# EAGLE design COUNTER (EAGLE 7.5.0)
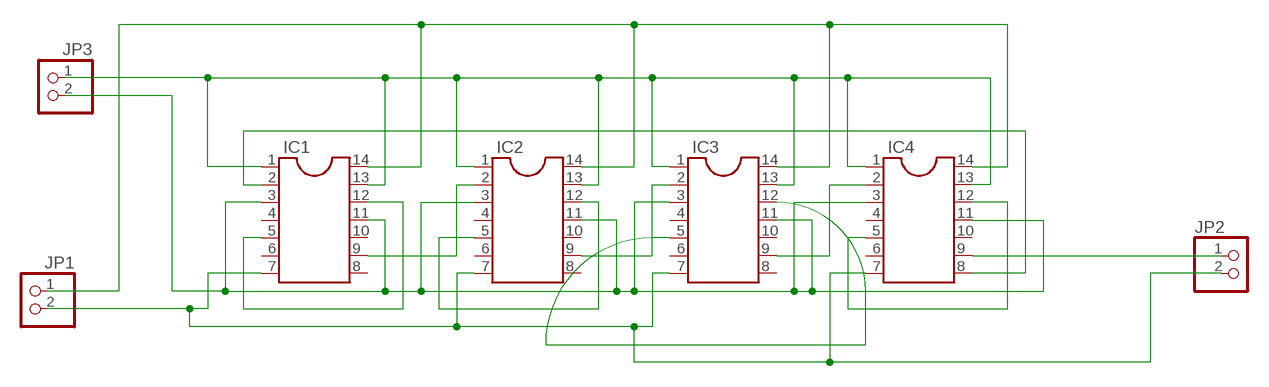
[diagram p0: schematic, sheet 1]

## Parts
IC1  DIL14  [DIL14]
IC2  DIL14  [DIL14]
IC3  DIL14  [DIL14]
IC4  DIL14  [DIL14]
JP1  PINHD-1X2  [1X02]
JP2  PINHD-1X2  [1X02]
JP3  PINHD-1X2  [1X02]

## Nets
N$1: IC1.3 IC1.11 IC2.3 IC2.11 IC3.3 IC3.11 IC4.3 IC4.11 JP3.2
N$2: IC1.2 IC4.8
N$3: IC1.5 IC1.12
N$4: IC1.9 IC2.2
N$5: IC2.5 IC2.12
N$6: IC2.9 IC3.2
N$7: IC3.5 IC3.12
N$8: IC3.9 IC4.2
N$9: IC4.5 IC4.12
N$10: IC1.1 IC1.13 IC2.1 IC2.13 IC3.1 IC3.13 IC4.1 IC4.13 JP3.1
N$12: IC1.14 IC2.14 IC3.14 IC4.14 JP1.1
N$13: IC1.7 IC2.7 IC3.7 IC4.7 JP1.2 JP2.2
N$17: IC4.9 JP2.1
Unconnected: IC1.4 IC1.6 IC1.8 IC1.10 IC2.4 IC2.6 IC2.8 IC2.10 IC3.4 IC3.6 IC3.8 IC3.10 IC4.4 IC4.6 IC4.10

## Library data of the parts
IC1-IC4 = ic-package:DIL14: Dual In Line / Socket
JP1-JP3 = pinhead:PINHD-1X2: PIN HEADER

## Board
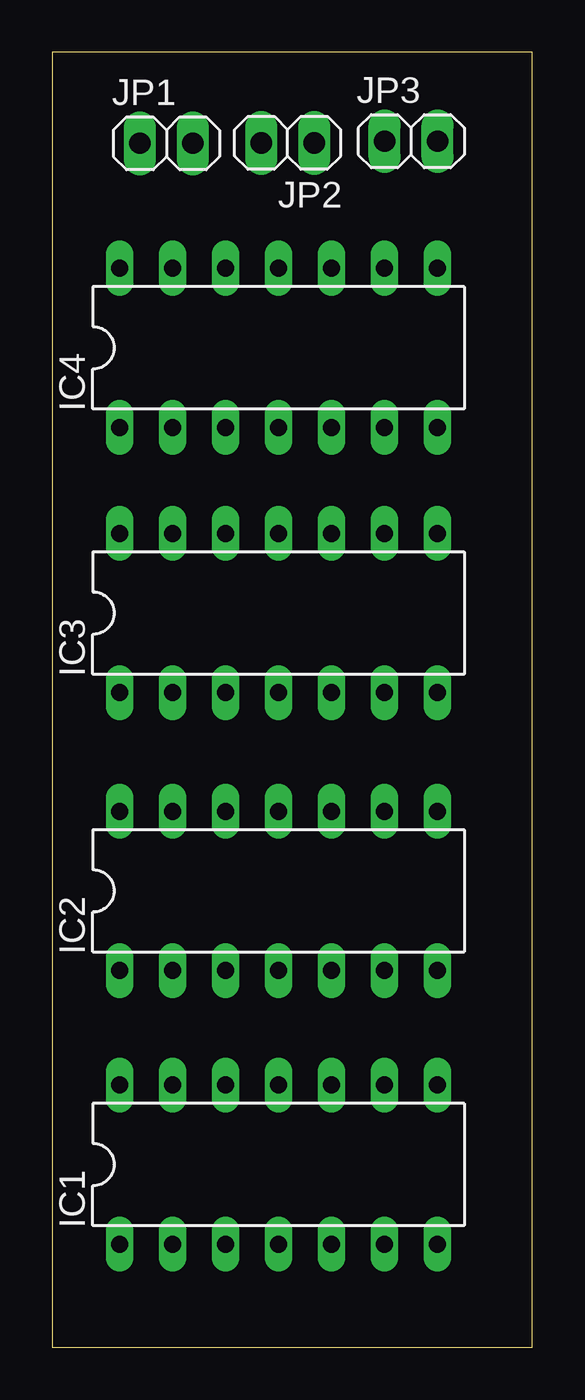
[diagram p1: board, top side]
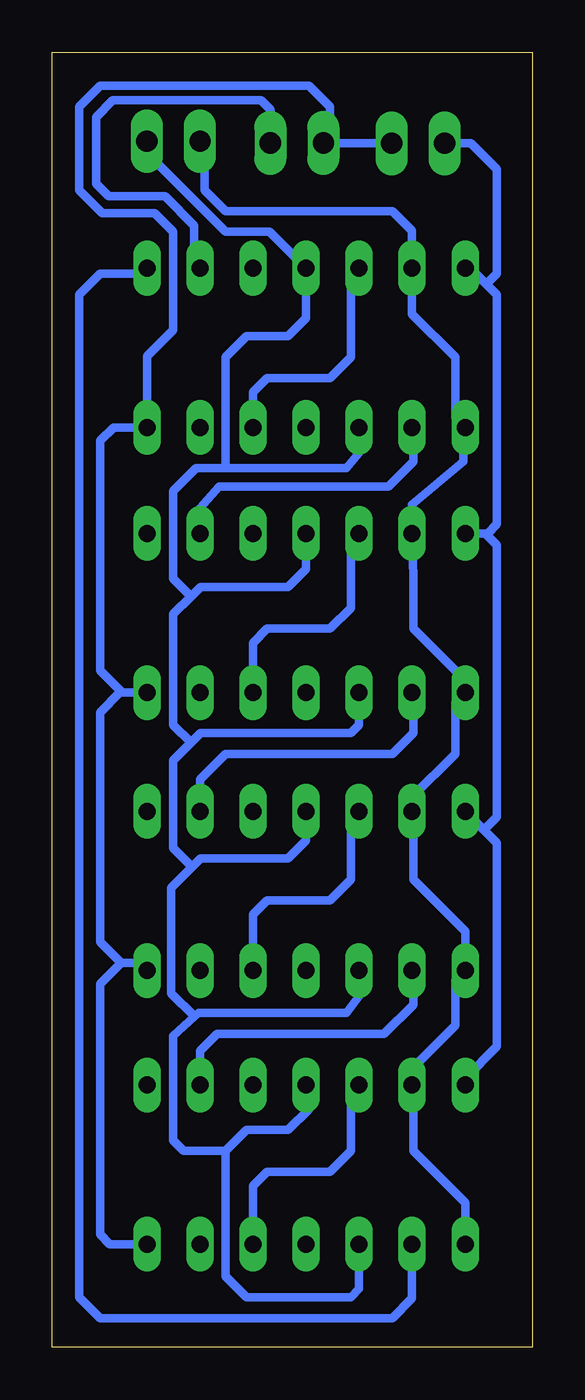
[diagram p2: board, bottom side, seen from below]

Size 23 x 62 mm. Coordinates in mm from the lower left corner, seen from the top.
Outline: 0,0 23,0 23,62 0,62 0,0
Copper layers (1*16): Top 0.035mm / dielectric 1.5mm / Bottom 0.035mm
Design rules "default": minimum track width 10mil, minimum drill 24mil, track to track 8mil, track to pad 8mil, pad to pad 8mil, via to via 8mil, smd to smd 8mil, copper to edge 40mil, drill to drill 8mil, minimum pad ring 10mil, minimum via ring 8mil, stop-mask expansion 4mil, vias tented up to drill 0mil, thermal gap 10mil

### Footprints (pad centres in the part's own frame; a part is rotated, then mirrored left to right if it is on the bottom)
DIL14 = drill 0.813 long: 1 -7.62,-3.81; 2 -5.08,-3.81; 3 -2.54,-3.81; 4 0,-3.81; 5 2.54,-3.81; 6 5.08,-3.81; 7 7.62,-3.81; 8 7.62,3.81; 9 5.08,3.81; 10 2.54,3.81; 11 0,3.81; 12 -2.54,3.81; 13 -5.08,3.81; 14 -7.62,3.81
1X02 = drill 1.016 long: 1 -1.27,0; 2 1.27,0

### Placement (x,y rotation side)
IC1  10.84,8.75 0 top
IC2  10.84,21.85 0 top
IC3  10.84,35.15 0 top
IC4  10.84,47.85 0 top
JP1  5.47,57.64 0 top
JP2  11.28,57.66 180 top
JP3  17.19,57.74 0 top

### Tracks (layer width: path | path; a pad name or v marks a point on that pad's centre or on a via)
N$1
  Bottom 0.406: IC1.3 8.3,2.8 8.7,2.4 13.7,2.4 14.7,3.4 14.7,9.4 | 14.7,9.4 13.7,10.4 11.7,10.4 10.7,11.4 10.7,12.42 IC1.11 | IC2.3 8.3,16.8 8.9,16 16,16 16.18,15.83 | 16.18,15.83 17.2,14.9 17.2,9.9 16.7,9.4 14.7,9.4 | IC2.11 10.84,24.26 11.7,23.4 15.9,23.4 16.3,23 | 16.3,23 17.3,22 17.3,16.95 16.18,15.83 | IC3.3 8.3,29.8 8.7,29.4 15.9,29.4 16.35,28.95 | 16.35,28.95 17.2,28.1 17.2,23.9 16.3,23 | IC3.11 10.84,37.26 11.7,36.4 15.9,36.4 16.35,35.95 | 16.35,35.95 17.2,35.1 17.2,29.8 16.35,28.95 | IC4.3 8.3,42.8 8.9,42.1 14.7,42.1 | 14.7,42.1 16.1,42.1 17.2,41 17.2,36.8 16.35,35.95 | 14.7,42.1 14.7,47.4 13.7,48.4 11.7,48.4 10.84,49.26 IC4.11 12.58,53.4 14.7,53.4 18.46,57.16 JP3.2
N$2
  Bottom 0.406: IC1.2 5.76,2.34 6.7,1.4 20.7,1.4 21.7,2.4 21.7,50.4 20.7,51.4 18.72,51.4 IC4.8
N$3
  Bottom 0.406: IC1.5 13.38,7.72 12.7,8.4 9.7,8.4 8.7,9.4 8.7,12.16 IC1.12
N$4
  Bottom 0.406: IC1.9 15.92,14.18 15.1,15 7.1,15 5.7,16.4 5.7,17.98 IC2.2
N$5
  Bottom 0.406: IC2.5 13.38,20.72 12.7,21.4 9.7,21.4 8.7,22.4 8.7,25.26 IC2.12
N$6
  Bottom 0.406: IC2.9 15.92,27.18 14.7,28.4 6.7,28.4 5.7,29.4 5.7,31.28 IC3.2
N$7
  Bottom 0.406: IC3.5 13.38,33.72 12.7,34.4 9.7,34.4 8.7,35.4 8.7,38.56 IC3.12
N$8
  Bottom 0.406: IC3.9 15.92,40.18 15,41.2 6.9,41.2 5.7,42.4 5.7,43.98 IC4.2
N$9
  Bottom 0.406: IC4.5 13.38,45.72 12.7,46.4 9.7,46.4 8.7,47.4 8.7,51.26 IC4.12
N$10
  Bottom 0.406: IC1.1 3.22,6.92 5.7,9.4 5.7,12.5 IC1.13 5.76,13.34 3.7,15.4 3.7,17.56 IC2.1 3.22,19.92 5.7,22.4 5.7,25.6 IC2.13 5.76,26.34 3.7,28.4 3.7,30.86 IC3.1 3.22,31.92 5.7,34.4 5.7,36.9 IC3.13 5.76,40.34 3.3,42.4 3.3,43.46 IC4.1 3.7,44.52 3.7,47.4 5.76,49.46 IC4.13 5.76,53.46 6.7,54.4 14.7,54.4 15.7,55.4 15.7,57.52 JP3.1
N$12
  Bottom 0.406: IC1.14 3.22,12.88 1.7,14.4 1.7,24.14 2.33,24.77 | 2.33,24.77 IC2.14 | 2.33,24.77 1.7,25.4 1.7,38.4 2.26,38.96 IC3.14 2.14,38.96 1.7,39.4 1.7,50.4 2.2,50.9 | 2.2,50.9 2.7,51.4 2.96,51.4 IC4.14 | JP1.1 2.94,57.64 1.7,56.4 1.7,51.4 2.2,50.9
N$13
  Bottom 0.406: IC1.7 20.24,4.94 20.7,5.4 20.7,17.4 19.7,18.4 | 19.7,18.4 18.82,18.4 IC2.7 | IC3.7 19.7,31.34 | 19.7,31.34 19.76,31.34 20.7,30.4 20.7,19.4 19.7,18.4 | 19.7,31.34 19.7,31.4 20.7,32.4 20.7,43.4 20.06,44.04 IC4.7 18.46,47.44 17.2,48.7 17.2,53.4 18.1,54.3 20.6,54.3 21.7,55.4 21.7,59.4 20.7,60.4 10.7,60.4 9.7,59.4 9.7,57.97 JP2.2 9.99,57.64 JP1.2
N$17
  Bottom 0.406: JP2.1 12.55,59.25 13,59.7 20.1,59.7 20.9,58.9 20.9,55.7 20.3,55.1 17.6,55.1 16.2,53.7 16.2,51.94 IC4.9